# Altium schematic sheet 2_Power2.SCHDOC
size 297 x 209 mm; SheetNumber: 5; SheetTotal: 18; DocumentName: 2_Power2.SCHDOC
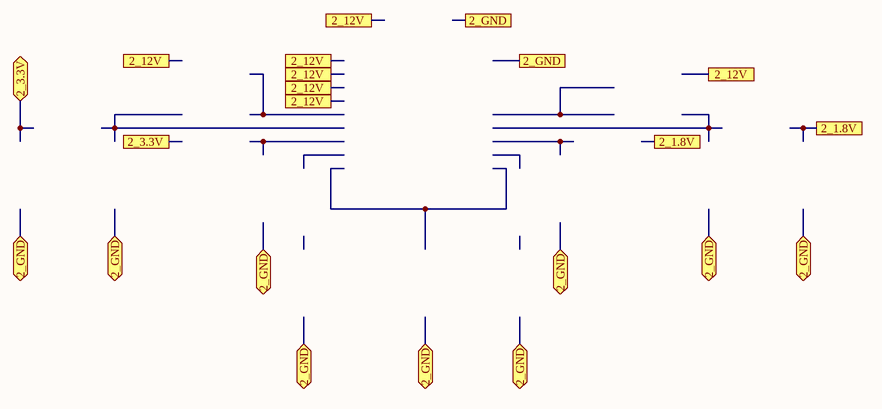
[diagram p0: 2_Power2.SCHDOC]

## Ports
2_1.8V, 2_3.3V, 2_12V, 2_GND

## Notes on the sheet
- A
- B
- C
- D
- 1
- 2
- 3
- Title
- 4
- Size
- A4
- Number
- Rev
- Date
- Filename
- Drawn by
- Sheet
- of